# Altium project ADCSHubV2.PrjPcb
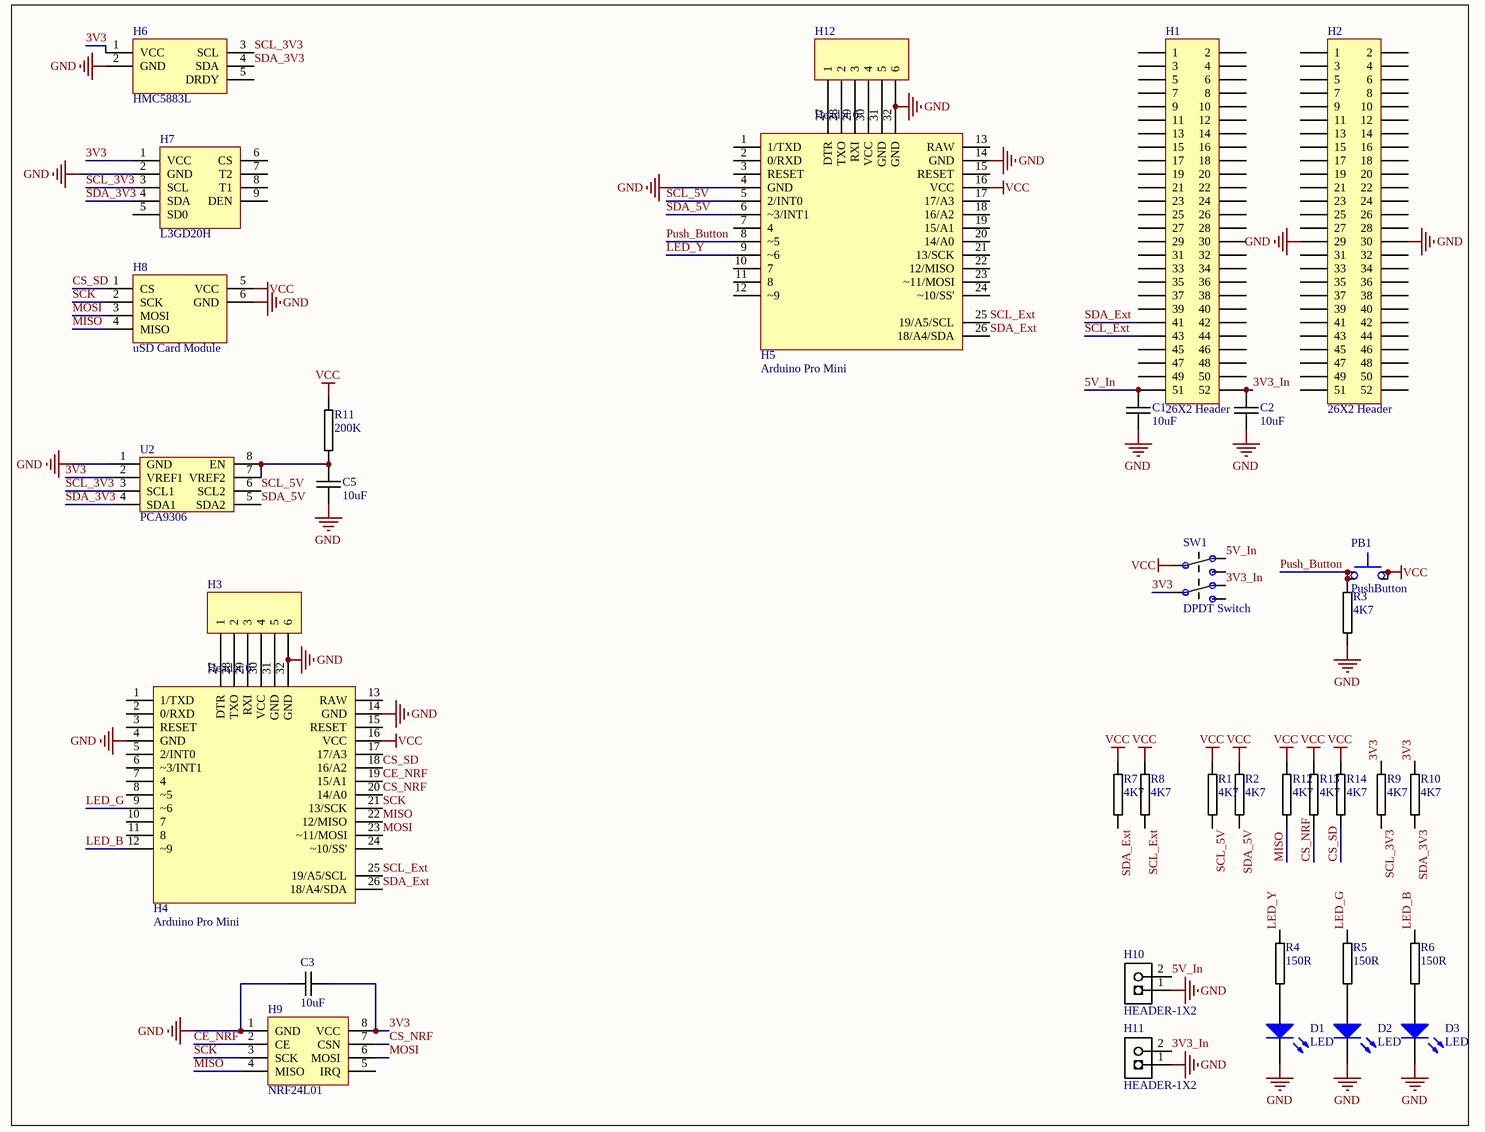
[diagram p0: ADCSHubV2.SchDoc]
1 sheet, 36 parts. Net scope: global (net labels, ports and power ports of the same name join across sheets).
Board file: ADCSHubV2.PcbDoc

## Sheet ADCSHubV2.SchDoc
size 274 x 210 mm

### Parts
C1  10uF  [0805C-TBD]
C2  10uF  [0805C-TBD]
C3  10uF  [0805C-GENERIC]
C5  10uF  [0805C-GENERIC]
D1  LED  [LED]
D2  LED  [LED]
D3  LED  [LED]
H1  26X2 Header  [26X2 Header]
H2  26X2 Header  [26X2 Header]
H3  Header 6  [HDR1X6]
H4  Arduino Pro Mini  [Arduino Pro Mini]
H5  Arduino Pro Mini  [Arduino Pro Mini]
H6  HMC5883L  [HMC5883L]
H7  L3GD20H  [L3GD20H]
H8  uSD Card Module  [uSD Card Module]
H9  NRF24L01  [NRF24L01]
H10  HEADER-1X2  [HEADER-1X2]
H11  HEADER-1X2  [HEADER-1X2]
H12  Header 6  [HDR1X6]
PB1  PushButton  [PushButton]
R1  4K7  [0805R-4K7]
R2  4K7  [0805R-4K7]
R3  4K7  [0805R-4K7]
R4  150R  [0805R-150]
R5  150R  [0805R-150]
R6  150R  [0805R-150]
R7  4K7  [0805R-4K7]
R8  4K7  [0805R-4K7]
R9  4K7  [0805R-4K7]
R10  4K7  [0805R-4K7]
R11  200K  [0805R-4K7]
R12  4K7  [0805R-4K7]
R13  4K7  [0805R-4K7]
R14  4K7  [0805R-4K7]
SW1  DPDT Switch  [DPDT SWITCH]
U2  PCA9306  [PCA9306 (DCT)]

### Nets
GND: C1.2 C2.2 C3.1 C5.2 D1.2(K) D2.2(K) D3.2(K) H2.29 H2.30 H3.6 H4.4(GND) H4.14(GND) H4.32(GND) H5.4(GND) H5.14(GND) H5.32(GND) H6.2(GND) H7.2(GND) H8.6(GND) H9.1(GND) H10.1 H11.1 H12.6 R3.2 U2.1(GND)
VCC: H4.16(VCC) H5.16(VCC) H8.5(VCC) PB1.27 PB1.29 R1.1 R2.1 R7.1 R8.1 R11.2 R12.1 R13.1 R14.1 SW1.2
3V3: C3.2 H6.1(VCC) H7.1(VCC) H9.8(VCC) R9.1 R10.1 SW1.5 U2.2(VREF1)
3V3_In: C2.1 H1.52 H11.2 SW1.4
5V_In: C1.1 H1.51 H10.2 SW1.1
CE_NRF: H4.19(15/A1) H9.2(CE)
CS_NRF: H4.20(14/A0) H9.7(CSN) R13.2
CS_SD: H4.18(16/A2) H8.1(CS) R14.2
LED_B: H4.12(~9) R6.1
LED_G: H4.9(~6) R5.1
LED_Y: H5.9(~6) R4.1
MISO: H4.22(12/MISO) H8.4(MISO) H9.4(MISO) R12.2
MOSI: H4.23(~11/MOSI) H8.3(MOSI) H9.6(MOSI)
Push_Button: H5.8(~5) PB1.26 PB1.28 R3.1
SCK: H4.21(13/SCK) H8.2(SCK) H9.3(SCK)
SCL_3V3: H6.3(SCL) H7.3(SCL) R9.2 U2.3(SCL1)
SCL_5V: H5.5(2/INT0) R1.2 U2.6(SCL2)
SCL_Ext: H1.43 H4.25(19/A5/SCL) H5.25(19/A5/SCL) R8.2
SDA_3V3: H6.4(SDA) H7.4(SDA) R10.2 U2.4(SDA1)
SDA_5V: H5.6(~3/INT1) R2.2 U2.5(SDA2)
SDA_Ext: H1.41 H4.26(18/A4/SDA) H5.26(18/A4/SDA) R7.2
NetC5_1: C5.1 R11.1 U2.7(VREF2) U2.8(EN)
NetD1_1: D1.1(A) R4.2
NetD2_1: D2.1(A) R5.2
NetD3_1: D3.1(A) R6.2
NetH3_1: H3.1 H4.27(DTR)
NetH3_2: H3.2 H4.28(TXO)
NetH3_3: H3.3 H4.29(RXI)
NetH3_4: H3.4 H4.30(VCC)
NetH3_5: H3.5 H4.31(GND)
NetH5_27: H5.27(DTR) H12.1
NetH5_28: H5.28(TXO) H12.2
NetH5_29: H5.29(RXI) H12.3
NetH5_30: H5.30(VCC) H12.4
NetH5_31: H5.31(GND) H12.5

Not connected (* = marked no-connect by the designer): H1 1 2 3 4 5 6 7 8 9 10 11 12 13 14 15 16 17 18 19 20 21 22 23 24 25 26 27 28 29 30 31 32 33 34 35 36 37 38 39 40 42 44 45 46 47 48 49 50; H2 1 2 3 4 5 6 7 8 9 10 11 12 13 14 15 16 17 18 19 20 21 22 23 24 25 26 27 28 31 32 33 34 35 36 37 38 39 40 41 42 43 44 45 46 47 48 49 50 51 52; H4 1(1/TXD) 2(0/RXD) 3(RESET) 5(2/INT0) 6(~3/INT1) 7(4) 8(~5) 10(7) 11(8) 13(RAW) 15(RESET) 17(17/A3) 24(~10/SS'); H5 1(1/TXD) 2(0/RXD) 3(RESET) 7(4) 10(7) 11(8) 12(~9) 13(RAW) 15(RESET) 17(17/A3) 18(16/A2) 19(15/A1) 20(14/A0) 21(13/SCK) 22(12/MISO) 23(~11/MOSI) 24(~10/SS'); H6 5(DRDY); H7 5(SD0) 6(CS) 7(T2) 8(T1) 9(DEN); H9 5(IRQ); SW1 3 6

### Library data of the parts
C1 C2 = 0805C-100nF-25V-X7R-MUR: CAPACITOR 0805 CERAMIC; Supplier 1: Digi-Key; Supplier Part Number 1: 490-1673-1-ND
C3 C5 = 0805C-10UF-16V-X5R-TDK: CAPACITOR 0805 CERAMIC; Manufacturer Part Number: C2012X5R1C106M; Manufacturer: TDK Corporation; REEL: C63; Supplier 1: Digi-Key; Supplier Part Number 1: 445-4115-2-ND
D1-D3 = LED: Small LED
H3 H12 = Header 6: Header, 6-Pin; LatestRevisionDate: 17-Jul-2002; LatestRevisionNote: Re-released for DXP Platform.; Publisher: Altium Limited
H6 = HMC5883L: Magnetometer
H7 = L3GD20H: Gyroscope
H9 = NRF24L01: Radio Transceiver
H10 H11 = HEADER-1X2: REEL: TH; Supplier 1: Digi-Key; Supplier Part Number 1: S1011E-36-ND
PB1 = PushButton: pin to pad: 26>5 27>7 28>6 29>8
R1-R3 R7-R14 = 0805R-4K7: RESISTOR 0805 1/4 WATT THIN FILM; Reel: *
R4-R6 = 0805R-150: RESISTOR 0805 1/4 WATT THIN FILM; Reel: *
U2 = PCA9306: Dual Bidirectional I2C Voltage Level Translator